# Altium schematic sheet Modbus RTU.SchDoc
size A4; SheetNumber: 6; SheetTotal: 6
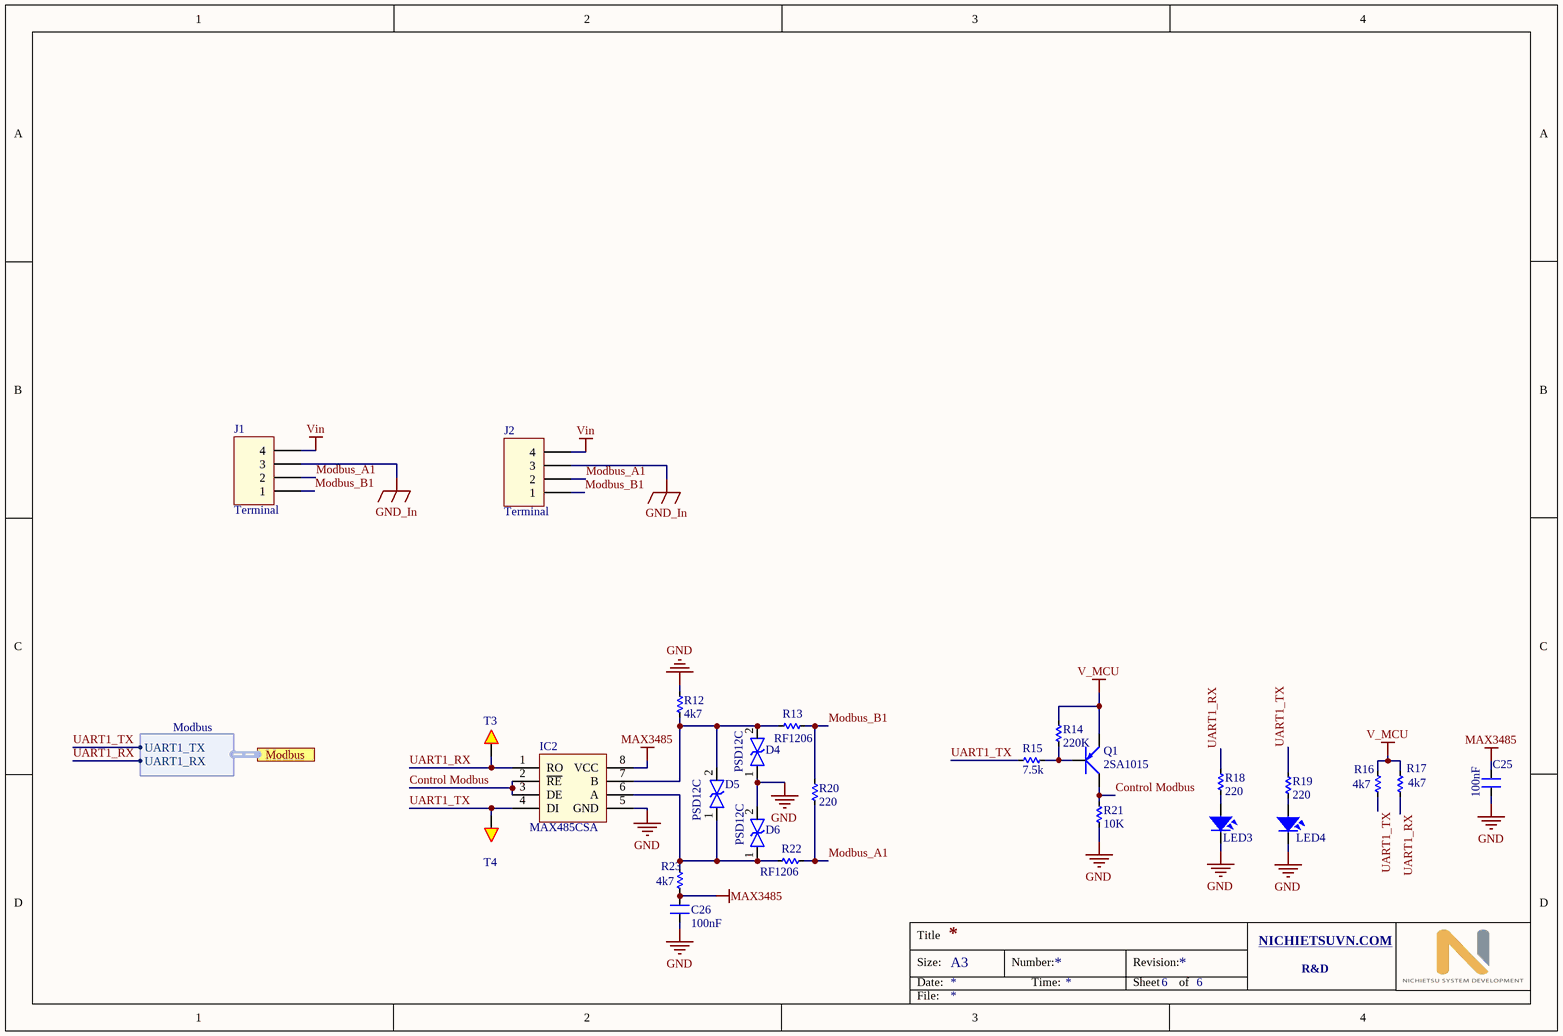
[diagram p0: Modbus RTU.SchDoc]

## Parts
C25  100nF  [CN-SMD-0603]
C26  100nF  [CN-SMD-0603]
D4  PSD12C  [PSD12C]
D5  PSD12C  [PSD12C]
D6  PSD12C  [PSD12C]
IC2  MAX485CSA  [SO8]
J1  Terminal  [691305340004]
J2  Terminal  [691305340004]
LED3  LED  [LED-0805-Blue]  (value not drawn)
LED4  LED  [LED-0805-Blue]  (value not drawn)
Q1  2SA1015  [SOT23-321]
R12  4k7  [RES-SMD-0603]
R13  RF1206  [RES-SMD-1206]
R14  220K  [RES-SMD-0603]
R15  7.5k  [RES-SMD-0603]
R16  4k7  [RES-SMD-0603]
R17  4k7  [RES-SMD-0603]
R18  220  [RES-SMD-0603]
R19  220  [RES-SMD-0603]
R20  220  [RES-SMD-0603]
R21  10K  [RES-SMD-0603]
R22  RF1206  [RES-SMD-1206]
R23  4k7  [RES-SMD-0603]
T3  Test  [Test]  (value not drawn)
T4  Test  [Test]  (value not drawn)

## Ports
Modbus (harness Modbus)

## Harnesses
Modbus: UART1_TX, UART1_RX

## Nets
GND: C25.1 C26.2 D4.1 D6.2 IC2.5(GND) LED3.2 LED4.2 R12.1 R21.1
GND_In: J1.3 J2.3
MAX3485: C25.2 C26.1 IC2.8(VCC) R23.1
V_MCU: Q1.1(E) R14.2 R16.1 R17.1
Vin: J1.4 J2.4
Control Modbus: IC2.2(~{RE}) IC2.3(DE) Q1.2(C) R21.2
Modbus_A1: J1.2 J2.2 R20.2 R22.1
Modbus_B1: J1.1 J2.1 R13.1 R20.1
UART1_RX: IC2.1(RO) R17.2 R18.1 T3.1 ; port Modbus.UART1_RX
UART1_TX: IC2.4(DI) R15.1 R16.2 R19.1 T4.1 ; port Modbus.UART1_TX
NetD4_2: D4.2 D5.2 IC2.7(B) R12.2 R13.2
NetD5_1: D5.1 D6.1 IC2.6(A) R22.2 R23.2
NetLED3_1: LED3.1 R18.2
NetLED4_1: LED4.1 R19.2
NetQ1_3: Q1.3(B) R14.1 R15.2

## Notes on the sheet
- Title
- Size:
- Date:
- A3
- Number:
- Time:
- Revision:
- Sheet
- of
- NICHIETSUVN.COM <http://NICHIETSUVN.COM>
- R&D
- File:

## Library data of the parts
C25 C26 = CN: Value: 33pF
D4-D6 = PSD12C: diode tvs
IC2 = MAX485: RS232 - RS485 (Same sn75176)
J1 J2 = 691305340004: WR-TBL Serie 3053 - 3.81 mm Horizontal PCB Header with Plastic Latch, 04p; Pitch: 3.81 mm; Published Date: Jan 2017; Publisher: Wurth Elektronik; ComponentLink1Description: Manufacturer; ComponentLink1URL: http://www.we-online.de; ComponentLink2Description: Datasheet; ComponentLink2URL: http://katalog.we-online.de/em/datasheet/691305340004.pdf; Part Number: 691305340004; Pin Number: 04p
LED3 LED4 = LED SMD: Value: LED 3 - 5 ly 2 Colour
Q1 = 2SA1015: PNP 600mW, ECB; Value: A1015
R12-R23 = Res-SMD: Resistor; Manufacturer: Generic Components; Class: Passive; Published: 08/06/2000; Publisher: Altium Hobart Technology Centre
T3 T4 = Test: WR-PHD 2.54 mm Angled Socket Header; Manufacturer: W¨¹rth Elektronik eiSos GmbH; partNo: 613002143121; ComponentLink1 Description: Manufacturer; ComponentLink2 Description: Datasheet; NoPins: 02; Created Date: 29 March 2013; ComponentLink1URL: http://www.we-online.com; ComponentLink2URL: http://katalog.we-online.de/em/datasheet/6130xx143121.pdf; Created by: Karrer Zheng